# EAGLE design untitled (EAGLE 7.6.0)
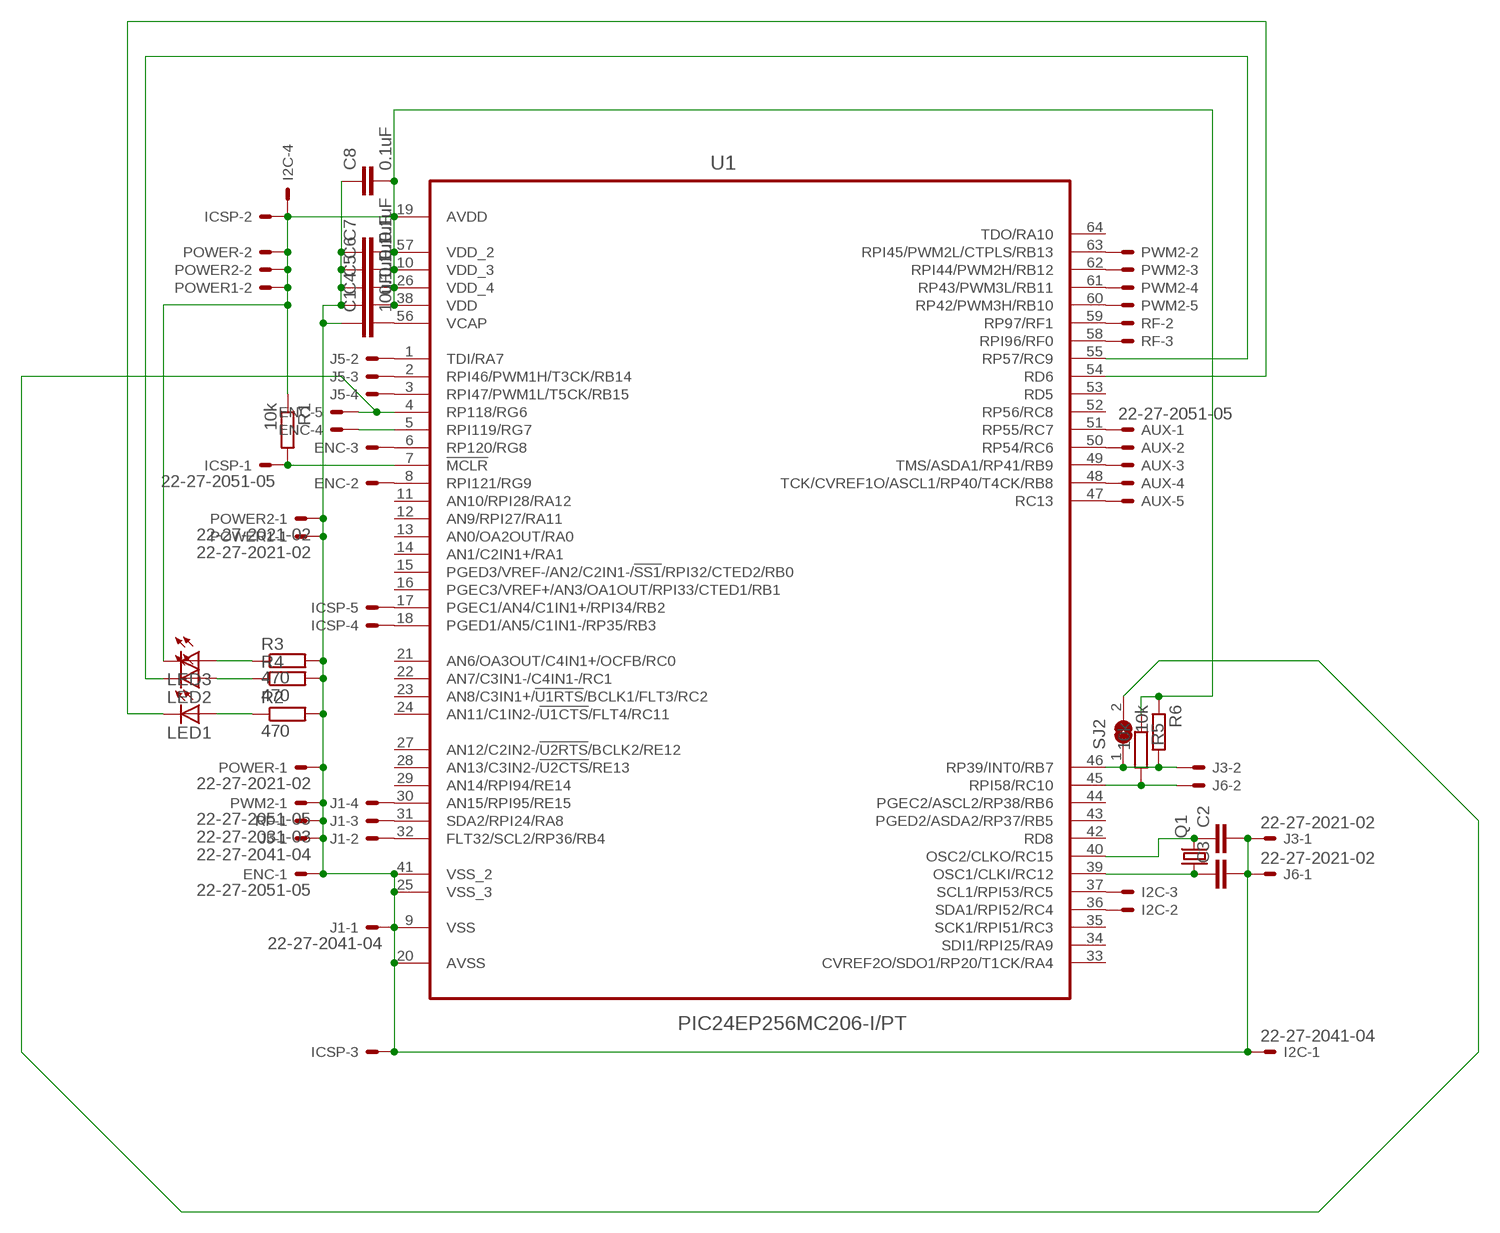
[diagram p0: schematic, sheet 1]

## Parts
AUX  22-27-2051-05  [6410-05]
C1  10uF  C-EUC0805  [C0805]
C2  C-EUC0603  [C0603]
C3  C-EUC0603  [C0603]
C4  0.1uF  C-EUC0805  [C0805]
C5  0.1uF  C-EUC0805  [C0805]
C6  0.1uF  C-EUC0805  [C0805]
C7  0.1uF  C-EUC0805  [C0805]
C8  0.1uF  C-EUC0805  [C0805]
ENC  22-27-2051-05  [6410-05]
I2C  22-27-2041-04  [6410-04]
ICSP  22-27-2051-05  [6410-05]
J1  22-27-2041-04  [6410-04]
J3  22-27-2021-02  [6410-02]
J5  22-27-2041-04  [6410-04]
J6  22-27-2021-02  [6410-02]
LED1  LEDCHIP-LED0603  [CHIP-LED0603]
LED2  LEDCHIP-LED0603  [CHIP-LED0603]
LED3  LEDCHIP-LED0603  [CHIP-LED0603]
POWER  22-27-2021-02  [6410-02]
POWER1  22-27-2021-02  [6410-02]
POWER2  22-27-2021-02  [6410-02]
PWM2  22-27-2051-05  [6410-05]
Q1  CRYSTALHC49S  [HC49/S]
R1  10k  R-EU_R0805  [R0805]
R2  470  R-EU_R0805  [R0805]
R3  470  R-EU_R0805  [R0805]
R4  470  R-EU_R0805  [R0805]
R5  10k  R-EU_R0805  [R0805]
R6  10k  R-EU_R0805  [R0805]
RF  22-27-2031-03  [6410-03]
SJ2  SJ  [SJ]
U1  PIC24EP256MC206-I/PT  [QFP50P1200X1200X120-64N]

## Nets
GND: C1.1 C2.2 C3.2 C4.1 C5.1 C6.1 C7.1 C8.1 ENC.1 I2C.1 ICSP.3 J1.1 J3.1 J5.1 J6.1 POWER1.1 POWER2.1 POWER.1 PWM2.1 R2.2 R3.2 R4.2 RF.1 U1.9(VSS) U1.20(AVSS) U1.25(VSS_3) U1.41(VSS_2)
N$1: C1.2 U1.56(VCAP)
N$2: ICSP.1 R1.2 U1.7(!MCLR)
N$3: C2.1 Q1.2 U1.40(OSC2/CLKO/RC15)
N$4: C3.1 Q1.1 U1.39(OSC1/CLKI/RC12)
N$5: ICSP.4 U1.18(PGED1/AN5/C1IN1-/RP35/RB3)
N$6: ICSP.5 U1.17(PGEC1/AN4/C1IN1+/RPI34/RB2)
N$7: I2C.2 U1.36(SDA1/RPI52/RC4)
N$8: I2C.3 U1.37(SCL1/RPI53/RC5)
N$9: PWM2.2 U1.63(RPI45/PWM2L/CTPLS/RB13)
N$10: PWM2.3 U1.62(RPI44/PWM2H/RB12)
N$11: PWM2.4 U1.61(RP43/PWM3L/RB11)
N$12: PWM2.5 U1.60(RP42/PWM3H/RB10)
N$13: RF.2 U1.59(RP97/RF1)
N$14: RF.3 U1.58(RPI96/RF0)
N$15: J5.2 U1.1(TDI/RA7)
N$16: J5.3 U1.2(RPI46/PWM1H/T3CK/RB14)
N$17: J5.4 U1.3(RPI47/PWM1L/T5CK/RB15)
N$18: ENC.5 SJ2.2 U1.4(RP118/RG6)
N$19: ENC.4 U1.5(RPI119/RG7)
N$20: ENC.3 U1.6(RP120/RG8)
N$21: ENC.2 U1.8(RPI121/RG9)
N$22: LED1.A R2.1
N$23: LED2.A R4.1
N$24: LED3.A R3.1
N$25: AUX.5 U1.47(RC13)
N$26: AUX.4 U1.48(TCK/CVREF1O/ASCL1/RP40/T4CK/RB8)
N$27: AUX.3 U1.49(TMS/ASDA1/RP41/RB9)
N$28: AUX.2 U1.50(RP54/RC6)
N$29: AUX.1 U1.51(RP55/RC7)
N$30: LED2.C U1.55(RP57/RC9)
N$31: LED1.C U1.54(RD6)
N$32: J1.2 U1.32(FLT32/SCL2/RP36/RB4)
N$33: J1.3 U1.31(SDA2/RPI24/RA8)
N$34: J3.2 R6.2 SJ2.1 U1.46(RP39/INT0/RB7)
N$35: J6.2 R5.2 U1.45(RPI58/RC10)
N$36: J1.4 U1.30(AN15/RPI95/RE15)
VDD: C4.2 C5.2 C6.2 C7.2 C8.2 I2C.4 ICSP.2 LED3.C POWER1.2 POWER2.2 POWER.2 R1.1 R5.1 R6.1 U1.10(VDD_3) U1.19(AVDD) U1.26(VDD_4) U1.38(VDD) U1.57(VDD_2)
Unconnected: U1.11(AN10/RPI28/RA12) U1.12(AN9/RPI27/RA11) U1.13(AN0/OA2OUT/RA0) U1.14(AN1/C2IN1+/RA1) U1.15(PGED3/VREF-/AN2/C2IN1-/!SS1!/RPI32/CTED2/RB0) U1.16(PGEC3/VREF+/AN3/OA1OUT/RPI33/CTED1/RB1) U1.21(AN6/OA3OUT/C4IN1+/OCFB/RC0) U1.22(AN7/C3IN1-/C4IN1-/RC1) U1.23(AN8/C3IN1+/!U1RTS!/BCLK1/FLT3/RC2) U1.24(AN11/C1IN2-/!U1CTS!/FLT4/RC11) U1.27(AN12/C2IN2-/!U2RTS!/BCLK2/RE12) U1.28(AN13/C3IN2-/!U2CTS!/RE13) U1.29(AN14/RPI94/RE14) U1.33(CVREF2O/SDO1/RP20/T1CK/RA4) U1.34(SDI1/RPI25/RA9) U1.35(SCK1/RPI51/RC3) U1.42(RD8) U1.43(PGED2/ASDA2/RP37/RB5) U1.44(PGEC2/ASCL2/RP38/RB6) U1.52(RP56/RC8) U1.53(RD5) U1.64(TDO/RA10)

## Library data of the parts
AUX ENC ICSP PWM2 = con-molex:22-?-05: CONNECTOR wire to board 2.54 mm (.1 inch) pitch header; OC_FARNELL: unknown; OC_NEWARK: unknown
C1-C8 = resistor:C-EU: CAPACITOR, European symbol
I2C J1 J5 = con-molex:22-?-04: CONNECTOR wire to board 2.54 mm (.1 inch) pitch header; OC_FARNELL: unknown; OC_NEWARK: unknown
J3 J6 POWER POWER1 POWER2 = con-molex:22-?-02: CONNECTOR wire to board 2.54 mm (.1 inch) pitch header; OC_FARNELL: unknown; OC_NEWARK: unknown
LED1-LED3 = led:LED: LED OSRAM: - CHIPLED LG R971, LG N971, LY N971, LG Q971, LY Q971, LO R971, LY R971 LH N974, LH R974 LS Q976, LO Q976, LY Q976 LO Q996 - Hyper CHIPLED LW Q18S LB Q993, LB Q99A, LB R99A - SideLED LS A670, LO A670, LY A670, LG A670, LP A670 LB A673, LV A673, LT A673, LW A673 LH A674 LY A675 LS A676, LA A676, LO A676, LY A676, LW A676 LS A679, LY A679, LG A679 - Hyper Micro SIDELED® LS Y876, LA Y876, LO Y876, LY Y876 LT Y87S - SmartLED LW L88C, LW L88S LB L89C, LB L89S, LG L890 LS L89K, LO L89K, LY L89K LS L896, LA L896, LO L896, LY L896 - TOPLED LS T670, LO T670, LY T670, LG T670, LP T670 LSG T670, LSP T670, LSY T670, LOP T670, LYG T670 LG T671, LOG T671, LSG T671 LB T673, LV T673, LT T673, LW T673 LH T674 LS T676, LA T676, LO T676, LY T676, LB T676, LH T676, LSB T676, LW T676 LB T67C, LV T67C, LT T67C, LS T67K, LO T67K, LY T67K, LW E67C LS E67B, LA E67B, LO E67B, LY E67B, LB E67C, LV E67C, LT E67C LW T67C LS T679, LY T679, LG T679 LS T770, LO T770, LY T770, LG T770, LP T770 LB T773, LV T773, LT T773, LW T773 LH T774 LS E675, LA E675, LY E675, LS T675 LS T776, LA T776, LO T776, LY T776, LB T776 LHGB T686 LT T68C, LB T68C - Hyper Mini TOPLED® LB M676 - Mini TOPLED Santana® LG M470 LS M47K, LO M47K, LY M47K Source: http://www.osram.convergy.de LUXEON: - LUMILED® LXK2-PW12-R00, LXK2-PW12-S00, LXK2-PW14-U00, LXK2-PW14-V00 LXK2-PM12-R00, LXK2-PM12-S00, LXK2-PM14-U00 LXK2-PE12-Q00, LXK2-PE12-R00, LXK2-PE12-S00, LXK2-PE14-T00, LXK2-PE14-U00 LXK2-PB12-K00, LXK2-PB12-L00, LXK2-PB12-M00, LXK2-PB14-N00, LXK2-PB14-P00, LXK2-PB14-Q00 LXK2-PR12-L00, LXK2-PR12-M00, LXK2-PR14-Q00, LXK2-PR14-R00 LXK2-PD12-Q00, LXK2-PD12-R00, LXK2-PD12-S00 LXK2-PH12-R00, LXK2-PH12-S00 LXK2-PL12-P00, LXK2-PL12-Q00, LXK2-PL12-R00 Source: www.luxeon.com KINGBRIGHT: KA-3528ASYC Source: www.kingbright.com
Q1 = crystal:CRYSTAL: CRYSTAL; OC_FARNELL: 1667008; OC_NEWARK: unknown
R1-R6 = resistor:R-EU_: RESISTOR, European symbol
RF = con-molex:22-?-03: CONNECTOR wire to board 2.54 mm (.1 inch) pitch header; OC_FARNELL: unknown; OC_NEWARK: unknown
SJ2 = jumper:SJ: SMD solder JUMPER
U1 = microchip:PIC24EP256MC206-I/PT: IC, MCU, 16BIT, 256KB FLASH, 64TQFP; MPN: PIC24EP256MC206-I/PT; OC_FARNELL: 2212163; OC_NEWARK: 66T9184; PACKAGE: 64TQFP; SUPPLIER: Microchip

## Board
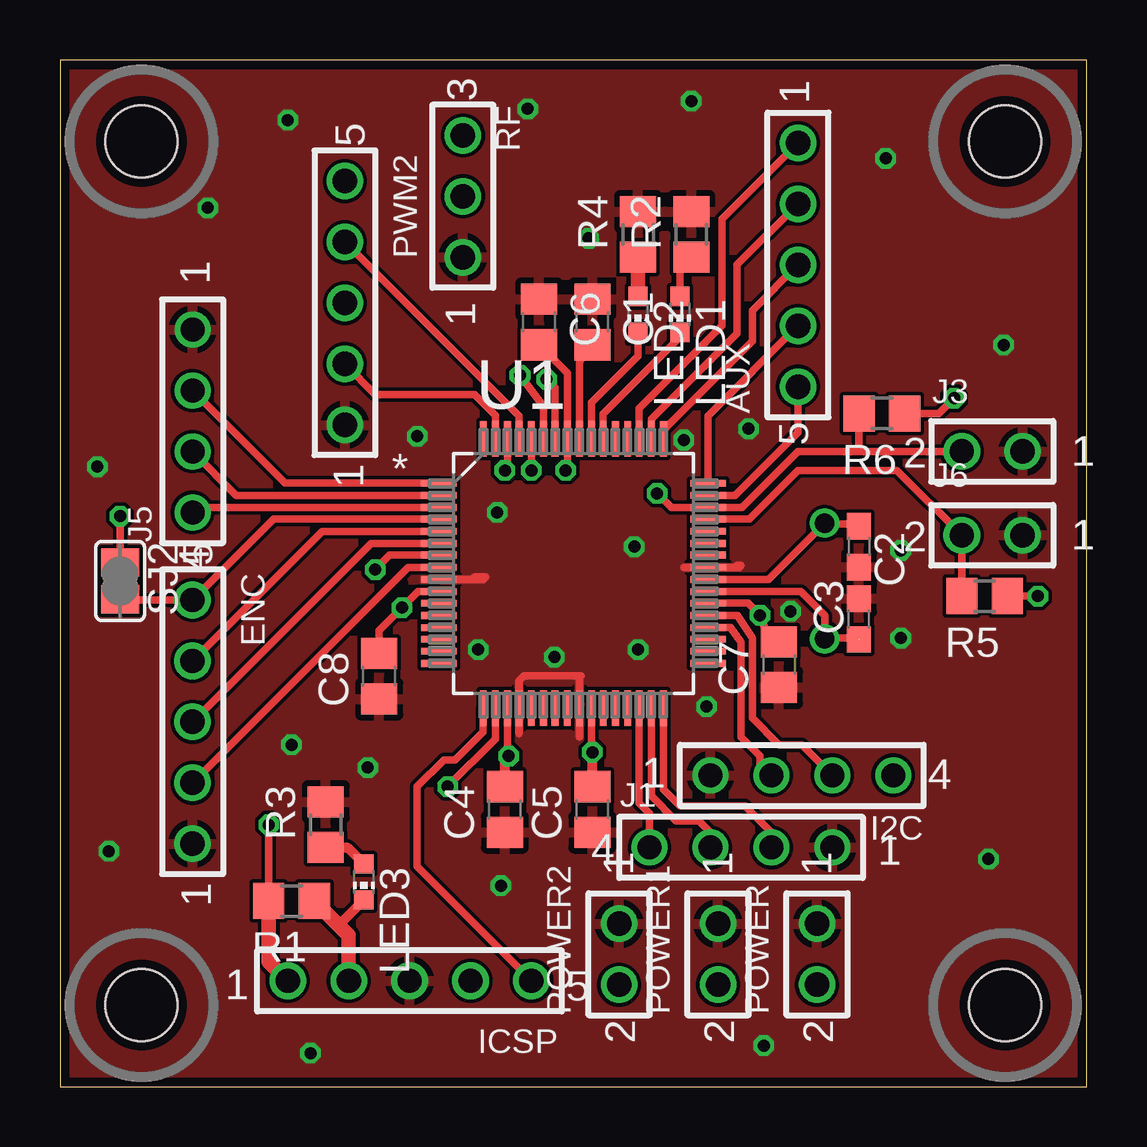
[diagram p1: board, top side]
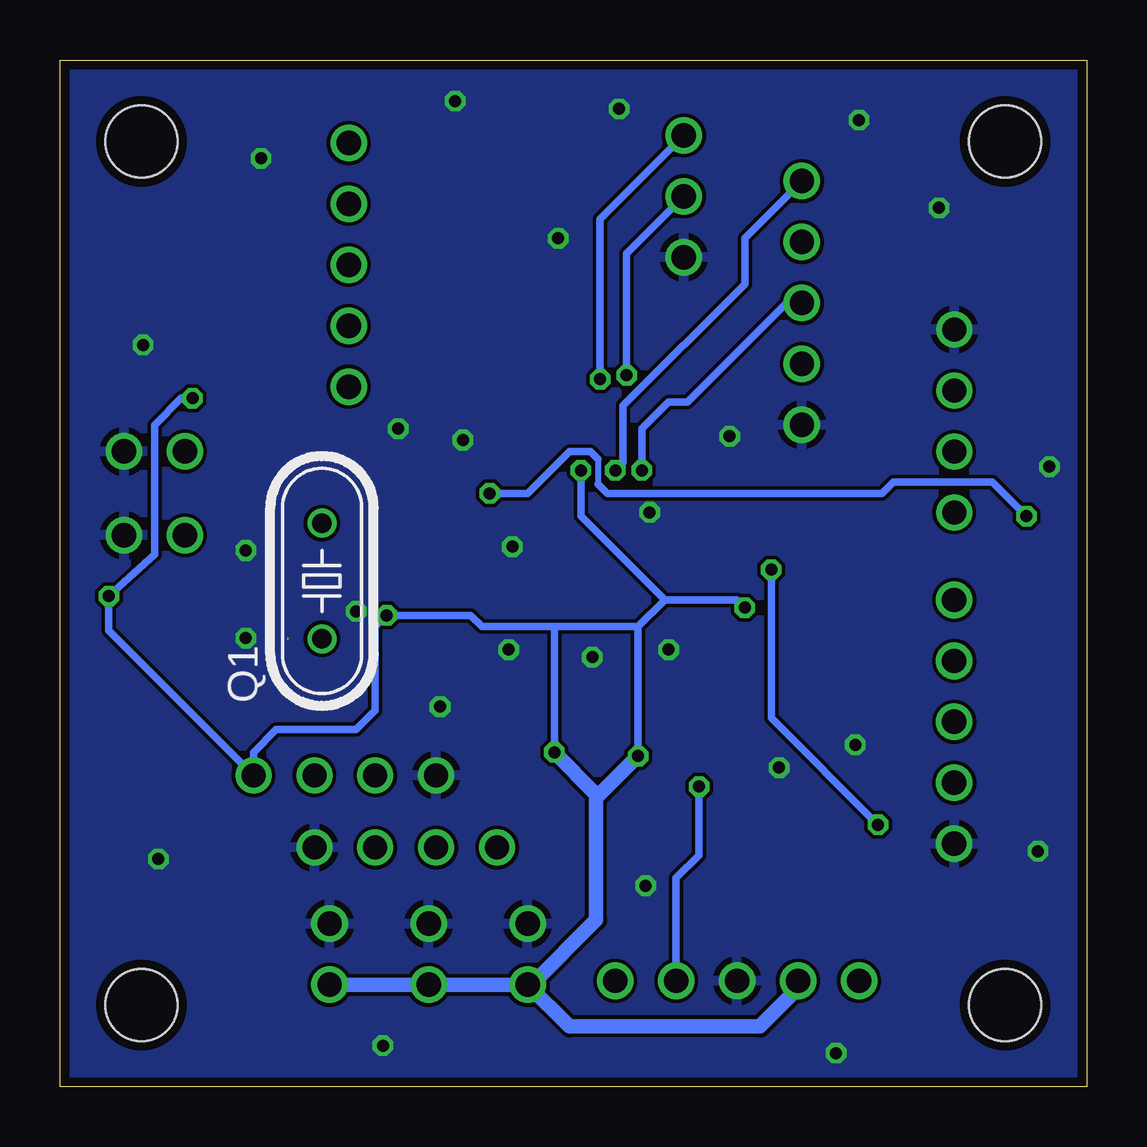
[diagram p2: board, bottom side, seen from below]

Size 42.8 x 42.8 mm. Coordinates in mm from the lower left corner, seen from the top.
Outline: 0,0 42.8,0 42.8,42.8 0,42.8 0,0
Copper layers (1*16): Top 0.0356mm / dielectric 1.5011mm / Bottom 0.0356mm
Design rules "oshpark-2layer *": minimum track width 6mil, minimum drill 13mil, track to track 6mil, track to pad 6mil, pad to pad 6mil, via to via 6mil, smd to smd 6mil, copper to edge 15mil, drill to drill 6mil, minimum pad ring 7mil, minimum via ring 7mil, stop-mask expansion 2.5mil, vias tented up to drill 20mil, thermal gap 10mil
Holes 3 mm at 39.4,39.4 3.4,39.4 3.4,3.4 39.4,3.4

### Footprints (pad centres in the part's own frame; a part is rotated, then mirrored left to right if it is on the bottom)
6410-05 = drill 1.016: 1 5.08,0; 2 2.54,0; 3 0,0; 4 -2.54,0; 5 -5.08,0
C0805 = smd 1.3 x 1.5: 1 -0.95,0; 2 0.95,0
C0603 = smd 1.1 x 1: 1 -0.85,0; 2 0.85,0
6410-04 = drill 1: 1 3.81,0; 2 1.27,0; 3 -1.27,0; 4 -3.81,0
6410-02 = drill 1.016: 1 1.27,0; 2 -1.27,0
CHIP-LED0603 = smd 0.8 x 0.8: A 0,-0.75; C 0,0.75
HC49/S = drill 0.813: 1 -2.413,0; 2 2.413,0
R0805 = smd 1.3 x 1.5: 1 -0.95,0; 2 0.95,0
6410-03 = drill 1.016: 1 2.54,0; 2 0,0; 3 -2.54,0
SJ = smd 1.168 x 1.6: 1 -0.762,0; 2 0.762,0
QFP50P1200X1200X120-64N = smd 1.473 x 0.279: 1 -5.613,3.759; 2 -5.613,3.251; 3 -5.613,2.743; 4 -5.613,2.261; 5 -5.613,1.753; 6 -5.613,1.245; 7 -5.613,0.762; 8 -5.613,0.254; 9 -5.613,-0.254; 10 -5.613,-0.762; 11 -5.613,-1.245; 12 -5.613,-1.753; 13 -5.613,-2.261; 14 -5.613,-2.743; 15 -5.613,-3.251; 16 -5.613,-3.759; 33 5.613,-3.759; 34 5.613,-3.251; 35 5.613,-2.743; 36 5.613,-2.261; 37 5.613,-1.753; 38 5.613,-1.245; 39 5.613,-0.762; 40 5.613,-0.254; 41 5.613,0.254; 42 5.613,0.762; 43 5.613,1.245; 44 5.613,1.753; 45 5.613,2.261; 46 5.613,2.743; 47 5.613,3.251; 48 5.613,3.759 | smd 0.279 x 1.473: 17 -3.759,-5.613; 18 -3.251,-5.613; 19 -2.743,-5.613; 20 -2.261,-5.613; 21 -1.753,-5.613; 22 -1.245,-5.613; 23 -0.762,-5.613; 24 -0.254,-5.613; 25 0.254,-5.613; 26 0.762,-5.613; 27 1.245,-5.613; 28 1.753,-5.613; 29 2.261,-5.613; 30 2.743,-5.613; 31 3.251,-5.613; 32 3.759,-5.613; 49 3.759,5.613; 50 3.251,5.613; 51 2.743,5.613; 52 2.261,5.613; 53 1.753,5.613; 54 1.245,5.613; 55 0.762,5.613; 56 0.254,5.613; 57 -0.254,5.613; 58 -0.762,5.613; 59 -1.245,5.613; 60 -1.753,5.613; 61 -2.261,5.613; 62 -2.743,5.613; 63 -3.251,5.613; 64 -3.759,5.613

### Placement (x,y rotation side)
AUX  30.77,34.26 90 top
C1  22.19,31.88 270 top
C2  33.31,22.51 270 top
C3  33.31,19.5 90 top
C4  18.54,11.56 90 top
C5  22.19,11.56 90 top
C6  19.97,31.88 270 top
C7  29.97,17.59 90 top
C8  13.3,17.11 90 top
ENC  5.53,15.21 270 top
I2C  30.92,12.99 180 top
ICSP  14.57,4.41 180 top
J1  28.38,9.97 0 top
J3  38.86,26.48 0 top
J5  5.53,27.75 90 top
J6  38.86,22.99 0 top
LED1  25.84,32.2 180 top
LED2  24.1,32.2 180 top
LED3  12.67,8.54 180 top
POWER  31.56,5.53 90 top
POWER1  27.43,5.53 90 top
POWER2  23.3,5.53 90 top
PWM2  11.88,32.67 270 top
Q1  31.88,21.08 90 bottom
R1  9.65,7.75 180 top
R2  26.32,35.53 90 top
R3  11.08,10.92 90 top
R4  24.1,35.53 90 top
R5  38.55,20.45 180 top
R6  34.26,28.07 180 top
RF  16.8,37.12 270 top
SJ2  2.51,21.08 270 top
U1  21.4,21.4 0 top

### Tracks (layer width: path | path; a pad name or v marks a point on that pad's centre or on a via)
GND  (via drill 0.5)
  Top 0.305: U1.41 28.32,21.65 28.38,21.72 28.23,21.72 | 27.11,21.65 26,21.65 | U1.9 17.65,21.15 17.75,21.24 17.27,21.24 | 19.14,14.73 U1.20 19.14,16.92 19.34,17.11 21.72,17.11 21.65,17.05 U1.25 21.65,14.57
  other vias: 6.16,36.64 20.61,17.91 24.1,18.23 23.94,22.51 18.23,23.94 17.43,18.23 22.04,35.37 28.7,27.43 14.89,27.11 12.83,13.3 26.96,15.84 35.05,22.35 35.05,18.7 18.38,8.38 9.65,14.26 1.56,25.84 2.03,9.81 10.45,1.4 38.7,9.49 39.34,30.92 34.42,38.7 26.32,41.09 19.5,40.77 9.49,40.29 29.34,1.71 26,26.96 30.45,19.81
  pour Top: 0,42.8 42.8,42.8 42.8,0 0,0
  pour Bottom: 0,42.8 42.8,42.8 42.8,0 0,0
N$1
  Top 0.305: U1.56 21.65,30.23 C1.2
N$2  (via drill 0.5)
  Top 0.305: U1.7 13.75,22.16 v13.14,21.56 | v8.7,10.92 R1.2
  Top 0.61: R1.2 8.7,5.21 ICSP.1
  Bottom 0.305: v13.14,21.56 13.14,15.37 v8.7,10.92
N$3
  Top 0.305: U1.40 29.53,21.15 Q1.2 31.91,23.46 33.31,23.46 33.12,23.28 33.12,23.18 C2.1
N$4  (1 unrouted)
  Top 0.305: U1.39 30.89,20.64 31.88,19.65 Q1.1 31.91,18.7 33.31,18.7 32.96,18.35
N$5  (via drill 0.5)
  Top 0.305: U1.18 18.15,14.5 v16.16,12.51
  Bottom 0.305: ICSP.4 17.11,8.7 16.16,9.65 v16.16,12.51
N$6
  Top 0.305: U1.17 17.64,14.78 16.48,13.62 16,13.62 14.89,12.51 14.89,9.18 ICSP.5
N$7
  Top 0.305: U1.36 27.95,19.14 28.38,18.54 28.38,14.57 29.18,13.78 29.18,13.46 I2C.2
N$8
  Top 0.305: U1.37 28.23,19.65 28.86,18.7 28.86,15.37 29.97,14.26 30.92,14.26 I2C.3
N$9
  Top 0.305: U1.63 18.15,27.98 17.27,28.86 13.14,28.86 PWM2.2
N$10  (via drill 0.5)
  Top 0.305: U1.62 18.66,25.8 v18.54,25.69
  Bottom 0.305: v18.54,25.69 18.54,27.43 17.43,28.54 16.64,28.54 12.51,32.67 PWM2.3
N$11
  Top 0.305: U1.61 19.14,27.95 PWM2.4
N$12  (via drill 0.5)
  Top 0.305: U1.60 v19.65,25.69
  Bottom 0.305: v19.65,25.69 19.34,26 19.34,28.38 14.26,33.47 14.26,35.37 PWM2.5
N$13  (via drill 0.5)
  Top 0.305: U1.59 20.16,28.36 v19.18,29.66
  Bottom 0.305: v19.18,29.66 19.18,34.73 RF.2
N$14  (via drill 0.5)
  Top 0.305: U1.58 20.64,29.15 v20.29,29.5
  Bottom 0.305: v20.29,29.5 20.29,36.16 RF.3
N$15
  Top 0.305: U1.1 9.39,25.16 J5.2
N$16
  Top 0.305: U1.2 7.35,24.65 J5.3
N$17
  Top 0.305: U1.3 5.73,24.14 J5.4
N$18
  Top 0.305: U1.4 8.9,23.66 ENC.5 1.91,20.29 SJ2.2
N$19
  Top 0.305: U1.5 10.93,23.15 ENC.4
N$20
  Top 0.305: U1.6 12.96,22.64 ENC.3
N$21
  Top 0.305: U1.8 14.51,21.65 ENC.2
N$22
  Top 0.305: LED1.A 25.84,33.94 26.48,34.73 R2.1
N$23
  Top 0.61: LED2.A R4.1
N$24
  Top 0.406: R3.1 11.99,9.97 LED3.A
N$25
  Top 0.305: U1.47 28.14,24.65 30.77,27.27 AUX.5
N$26
  Top 0.305: U1.48 27.01,27.97 AUX.4
N$27
  Top 0.305: U1.49 25.16,27.38 28.86,31.08 28.86,32.35 AUX.3
N$28
  Top 0.305: U1.50 24.65,27.83 28.23,31.4 28.23,34.26 AUX.2
N$29
  Top 0.305: U1.51 24.14,28.27 27.59,31.72 27.59,36.16 AUX.1
N$30
  Top 0.305: U1.55 22.16,28.51 24.1,30.45 LED2.C
N$31
  Top 0.305: U1.54 22.64,28.04 25.84,31.24 LED1.C
N$32
  Top 0.305: U1.32 25.16,12.4 25.84,11.72 28.54,11.72 29.66,10.61 J1.2
N$33
  Top 0.305: U1.31 24.65,12.12 25.69,11.08 26.64,11.08 27.11,10.61 J1.3
N$34  (via drill 0.5)
  Top 0.305: 33.78,26.48 30.77,26.48 28.43,24.14 U1.46 25.48,24.14 v24.89,24.73 | 33.78,26.48 J3.2 | R6.2 33.31,26.48 33.78,26.48 | v2.51,23.78 SJ2.1
  Bottom 0.254: 20.37,26.16 20.37,25.13
  Bottom 0.305: v24.89,24.73 23.3,24.73 21.56,26.48 20.69,26.48 20.37,26.16 | v2.51,23.78 3.94,25.21 8.06,25.21 8.54,24.73 19.97,24.73 20.37,25.13
N$35
  Top 0.305: U1.45 28.74,23.66 30.77,25.69 34.89,25.69 J6.2 37.59,22.67 R5.2
N$36
  Top 0.305: U1.30 24.14,11.83 24.57,11.4 J1.4
VDD  (via drill 0.5)
  Top 0.305: C6.2 21.15,29.75 U1.57 21.15,25.75 v21.08,25.69 | C7.2 29.5,18.86 v29.18,19.65 28.68,20.16 U1.38 | R6.1 36.64,28.07 v37.27,28.7 | U1.19 18.66,14.05 v18.7,13.78 | U1.26 22.16,14.13 v22.19,13.94 | U1.10 14.92,20.64 v14.26,19.97 13.3,19.02 C8.2 | R5.1 v40.77,20.45 | 12.03,6.32 11.67,6.79
  Top 0.406: C5.2 v22.19,13.94 | 11.67,6.79 LED3.C | C4.2 18.54,13.62 v18.7,13.78
  Top 0.61: R1.1 12.03,6.32 ICSP.2
  Bottom 0.305: v37.27,28.7 37.75,28.7 38.86,27.59 38.86,22.19 v40.77,20.45 40.77,19.02 I2C.4 34.73,13.94 33.78,14.89 30.45,14.89 29.66,15.68 29.66,19.18 v29.18,19.65 25.69,19.65 25.21,19.18 22.19,19.18 | v21.08,25.69 21.08,23.78 17.59,20.29 | 17.59,20.29 14.57,20.29 v14.26,19.97 | 17.59,20.29 18.7,19.18 | 18.7,19.18 v18.7,13.78 | v22.19,13.94 22.19,19.18 | 18.7,19.18 22.19,19.18
  Bottom 0.61: POWER.2 POWER1.2 POWER2.2 | ICSP.2 12.03,4.1 13.62,2.51 21.56,2.51 POWER2.2 | POWER2.2 23.15,4.26 20.45,6.95 20.45,12.03 | v18.7,13.78 20.45,12.03 | 20.45,12.03 20.45,12.19 v22.19,13.94